# EAGLE schematic Car Engine Room (EAGLE 5.11)
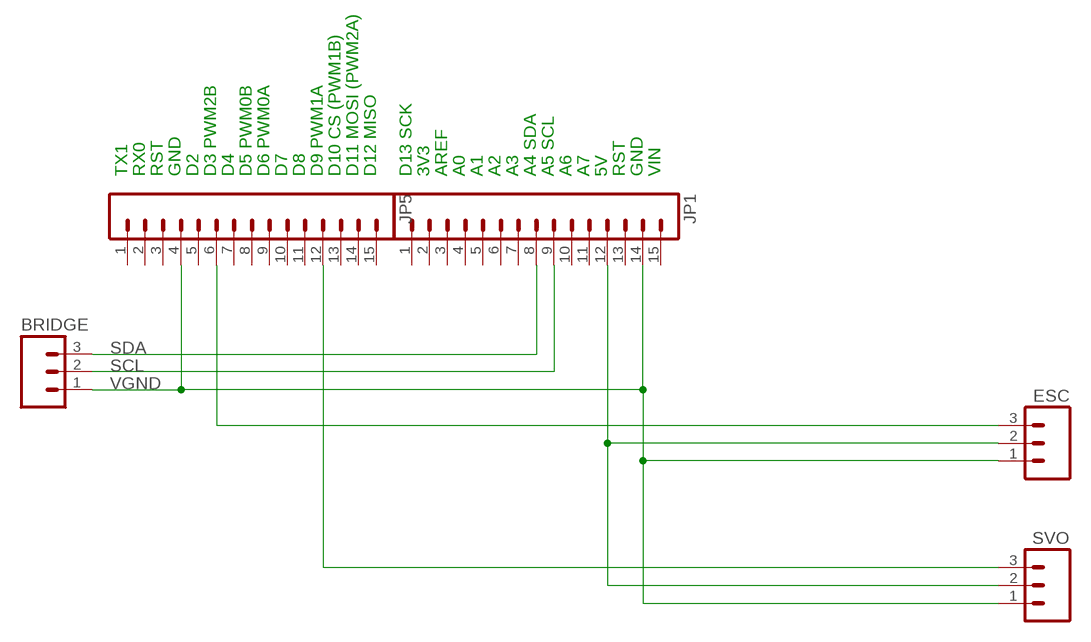
[diagram p0: schematic, sheet 1]

## Parts
BRIDGE  M03PTH  [1X03]
ESC  M03PTH  [1X03]
JP1  M15  [1X15]
JP5  M15  [1X15]
SVO  M03PTH  [1X03]

## Nets
IN1: ESC.3 JP5.6
IN2: JP5.12 SVO.3
SCL: BRIDGE.2 JP1.9
SDA: BRIDGE.3 JP1.8
VCC: ESC.2 JP1.12 SVO.2
VGND: BRIDGE.1 ESC.1 JP1.14 JP5.4 SVO.1
Unconnected: JP1.1 JP1.2 JP1.3 JP1.4 JP1.5 JP1.6 JP1.7 JP1.10 JP1.11 JP1.13 JP1.15 JP5.1 JP5.2 JP5.3 JP5.5 JP5.7 JP5.8 JP5.9 JP5.10 JP5.11 JP5.13 JP5.14 JP5.15

## Notes on the sheet
- TX1 | RX0 | RST | GND | D2 | D3 PWM2B | D4 | D5 PWM0B | D6 PWM0A | D7 | D8 | D9 PWM1A | D10 CS (PWM1B) | D11 MOSI (PWM2A) | D12 MISO | D13 SCK | 3V3 | AREF | A0 | A1 | A2 | A3 | A4 SDA | A5 SCL | A6 | A7 | 5V | RST | GND | VIN

## Library data of the parts
BRIDGE ESC SVO = SparkFun:M03: Header 3 Standard 3-pin 0.1" header. Use with straight break away headers (SKU : PRT-00116), right angle break away headers (PRT-00553), swiss pins (PRT-00743), machine pins (PRT-00117), and female headers (PRT-00115). Molex polarized connector foot print use with SKU : PRT-08232 with associated crimp pins and housings.
JP1 JP5 = SparkFun:M15: Header 15 Standard 15-pin 0.1" header. Use with straight break away headers (SKU : PRT-00116), right angle break away headers (PRT-00553), swiss pins (PRT-00743), machine pins (PRT-00117), and female headers (PRT-00115).

## Net classes
1 power: width 1.524 mm, clearance 0.254 mm